# EAGLE design temphumidity_1.1 (EAGLE 9.6.2)

## Sheet 1 of 2
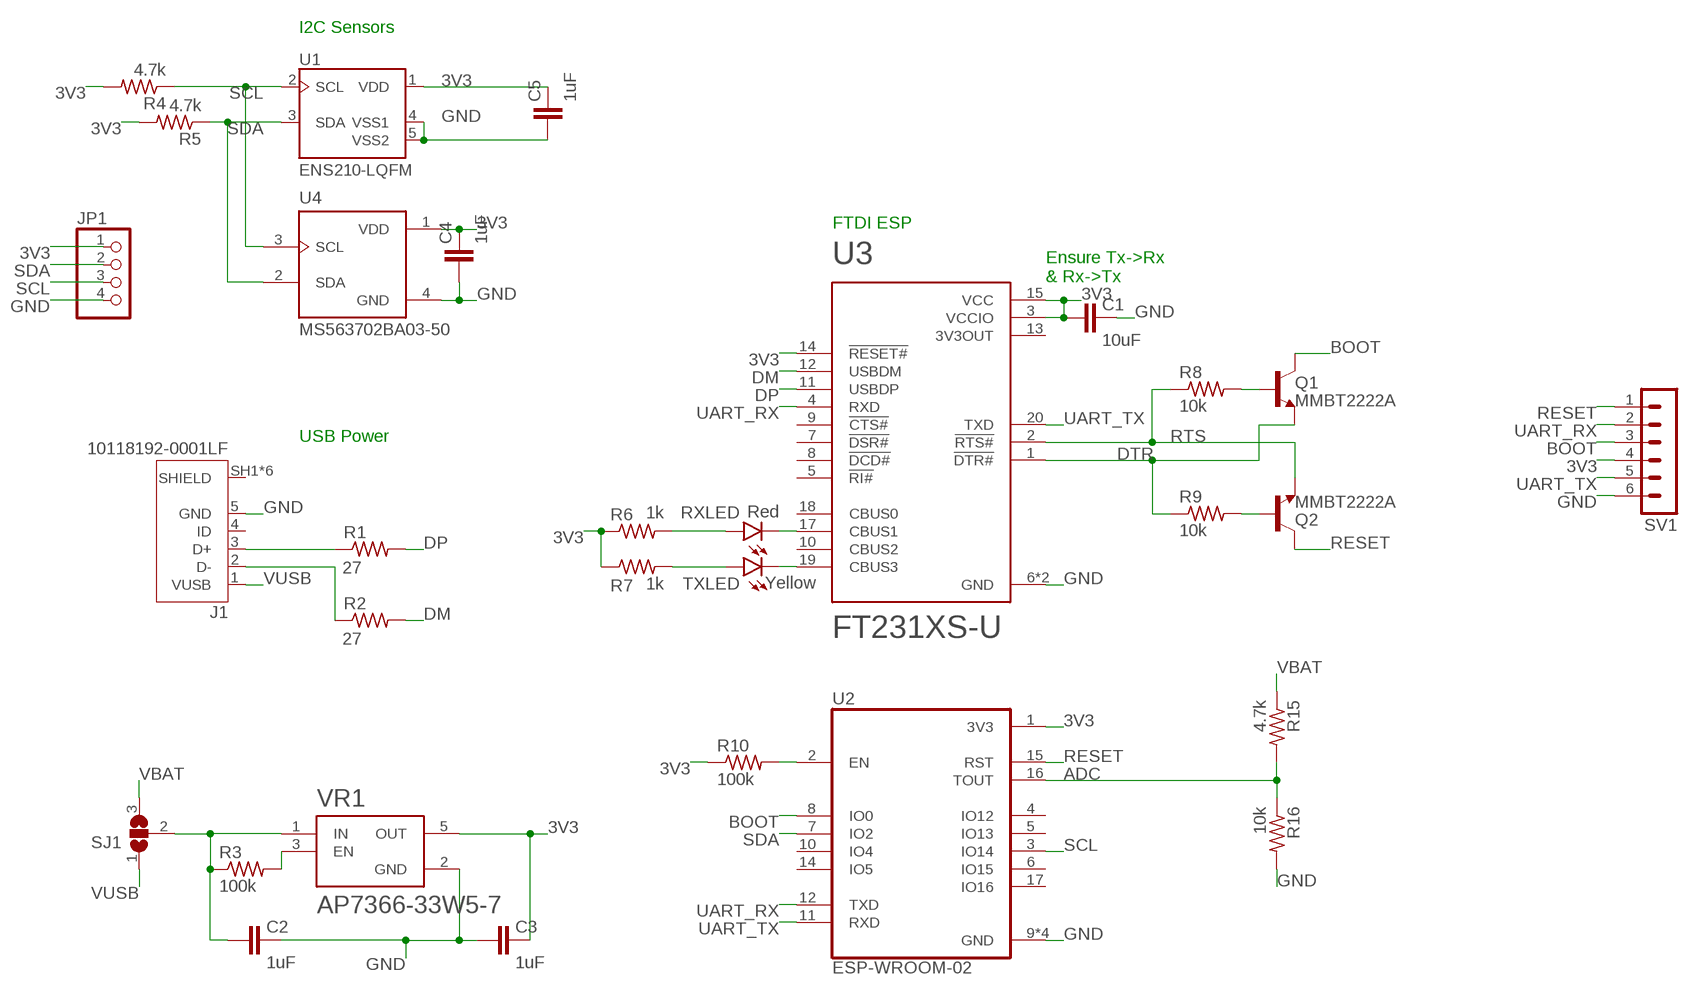
[diagram p0: schematic, sheet 1]

### Parts
C1  10uF  C-EUC0805  [C0805]
C2  1uF  C-EUC0805  [C0805]
C3  1uF  C-EUC0805  [C0805]
C4  1uF  C-EUC0805  [C0805]
C5  1uF  C-EUC0805  [C0805]
J1  10118192-0001LF  [AMPHENOL_10118192-0001LF]
JP1  PINHD-1X4  [1X04]
Q1  MMBT2222A  [SOT23]
Q2  MMBT2222A  [SOT23]
R1  27  R-US_R0805  [R0805]
R2  27  R-US_R0805  [R0805]
R3  100k  R-US_R0805  [R0805]
R4  4.7k  R-US_R0805  [R0805]
R5  4.7k  R-US_R0805  [R0805]
R6  1k  R-US_R0805  [R0805]
R7  1k  R-US_R0805  [R0805]
R8  10k  R-US_R0805  [R0805]
R9  10k  R-US_R0805  [R0805]
R10  100k  R-US_R0805  [R0805]
R15  4.7k  R-US_R0805  [R0805]
R16  10k  R-US_R0805  [R0805]
RXLED  Red  LEDCHIP-LED0805  [CHIP-LED0805]
SJ1  SJ2W  [SJ_2]
SV1  MA06-1  [MA06-1]
TXLED  Yellow  LEDCHIP-LED0805  [CHIP-LED0805]
U1  ENS210-LQFM  [SON95P200X200X80-5N160X70]
U2  ESP-WROOM-02  [MODULE_ESP-WROOM-02]
U3  FT231XS-U  [SOP63P600X175-20N]
U4  MS563702BA03-50  [TE_MS563702BA03-50]
VR1  AP7366-33W5-7  [SOT95P285X140-5N]

### Nets
3V3: C1.2 C3.1 C4.1 C5.1 JP1.1 R4.2 R5.2 R6.1 R7.1 R10.1 SV1.4 U1.1(VDD) U2.1(3V3) U3.3(VCCIO) U3.14(!RESET#) U3.15(VCC) U4.1(VDD) VR1.5(OUT)
ADC: R15.2 R16.1 U2.16(TOUT)
BOOT: Q1.3(C) SV1.3 U2.8(IO0)
DM: R2.2 U3.12(USBDM)
DP: R1.2 U3.11(USBDP)
DTR: Q1.2(E) R9.1 U3.1(!DTR#)
GND: C1.1 C2.1 C3.2 C4.2 C5.2 J1.5(GND) JP1.4 R16.2 SV1.6 U1.4(VSS1) U1.5(VSS2) U2.9(GND) U2.13(GND) U2.18(GND) U2.19(GND) U3.6(GND) U3.16(GND) U4.4(GND) VR1.2(GND) ; also sheet 2
N$1: J1.3(D+) R1.1
N$2: J1.2(D-) R2.1
N$3: R3.2 VR1.3(EN)
N$7: RXLED.C U3.17(CBUS1)
N$8: TXLED.C U3.19(CBUS3)
N$9: R6.2 RXLED.A
N$10: R7.2 TXLED.A
N$11: Q1.1(B) R8.2
N$12: Q2.1(B) R9.2
N$13: R10.2 U2.2(EN)
RESET: Q2.3(C) SV1.1 U2.15(RST)
RTS: Q2.2(E) R8.1 U3.2(!RTS#)
SCL: JP1.3 R4.1 U1.2(SCL) U2.3(IO14) U4.3(SCL)
SDA: JP1.2 R5.1 U1.3(SDA) U2.7(IO2) U4.2(SDA)
SELECTEDVOLTAGE: C2.2 R3.1 SJ1.2 VR1.1(IN)
UART_RX: SV1.2 U2.12(TXD) U3.4(RXD)
UART_TX: SV1.5 U2.11(RXD) U3.20(TXD)
VBAT: R15.1 SJ1.3 ; also sheet 2
VUSB: J1.1(VUSB) SJ1.1 ; also sheet 2
Unconnected: J1.4(ID) J1.SH1(SHIELD) J1.SH2(SHIELD) J1.SH3(SHIELD) J1.SH4(SHIELD) J1.SH5(SHIELD) J1.SH6(SHIELD) U2.4(IO12) U2.5(IO13) U2.6(IO15) U2.10(IO4) U2.14(IO5) U2.17(IO16) U3.5(!RI#) U3.7(!DSR#) U3.8(!DCD#) U3.9(!CTS#) U3.10(CBUS2) U3.18(CBUS0)

### Notes on the sheet
- I2C Sensors
- FTDI ESP
- Ensure Tx->Rx 
  & Rx->Tx
- USB Power

## Sheet 2 of 2
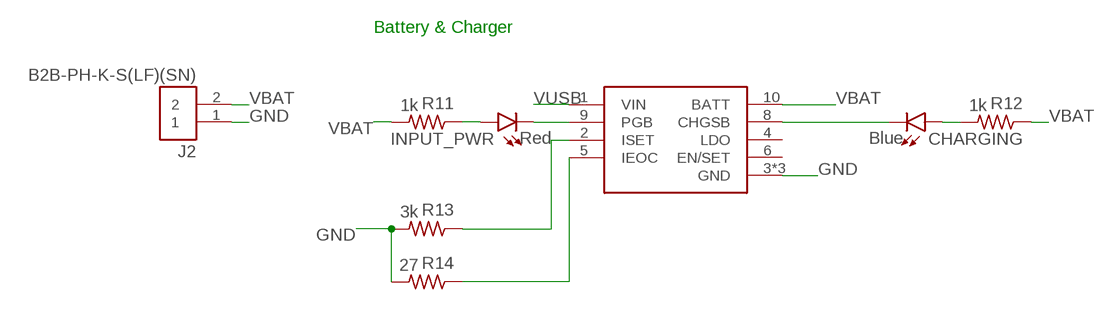
[diagram p1: schematic, sheet 2]

### Parts
CHARGING  Blue  LEDCHIP-LED0805  [CHIP-LED0805]
INPUT_PWR  Red  LEDCHIP-LED0805  [CHIP-LED0805]
J2  B2B-PH-K-S(LF)(SN)  [JST_B2B-PH-K-S(LF)(SN)]
R11  1k  R-US_R0805  [R0805]
R12  1k  R-US_R0805  [R0805]
R13  3k  R-US_R0805  [R0805]
R14  27  R-US_R0805  [R0805]
U$2  RT9532GQW  [SON50P300X300X80-11N]

### Nets
GND: J2.1 R13.2 R14.2 U$2.3(GND) U$2.7(GND) U$2.11(GND) ; also sheet 1
N$14: INPUT_PWR.C U$2.9(PGB)
N$15: CHARGING.C U$2.8(CHGSB)
N$16: INPUT_PWR.A R11.1
N$17: R13.1 U$2.2(ISET)
N$18: CHARGING.A R12.2
N$19: R14.1 U$2.5(IEOC)
VBAT: J2.2 R11.2 R12.1 U$2.10(BATT) ; also sheet 1
VUSB: U$2.1(VIN) ; also sheet 1
Unconnected: U$2.4(LDO) U$2.6(EN/SET)

### Notes on the sheet
- Battery & Charger

## Power pins joined to a net without a drawn wire
3V3OUT: U3.13(3V3OUT)

## Library data of the parts
C1-C5 = rcl:C-EU: CAPACITOR, European symbol; SPICEPREFIX: C
CHARGING INPUT_PWR RXLED TXLED = led:LED: LED OSRAM: - CHIPLED LG R971, LG N971, LY N971, LG Q971, LY Q971, LO R971, LY R971 LH N974, LH R974 LS Q976, LO Q976, LY Q976 LO Q996 - Hyper CHIPLED LW Q18S LB Q993, LB Q99A, LB R99A - SideLED LS A670, LO A670, LY A670, LG A670, LP A670 LB A673, LV A673, LT A673, LW A673 LH A674 LY A675 LS A676, LA A676, LO A676, LY A676, LW A676 LS A679, LY A679, LG A679 - Hyper Micro SIDELED® LS Y876, LA Y876, LO Y876, LY Y876 LT Y87S - SmartLED LW L88C, LW L88S LB L89C, LB L89S, LG L890 LS L89K, LO L89K, LY L89K LS L896, LA L896, LO L896, LY L896 - TOPLED LS T670, LO T670, LY T670, LG T670, LP T670 LSG T670, LSP T670, LSY T670, LOP T670, LYG T670 LG T671, LOG T671, LSG T671 LB T673, LV T673, LT T673, LW T673 LH T674 LS T676, LA T676, LO T676, LY T676, LB T676, LH T676, LSB T676, LW T676 LB T67C, LV T67C, LT T67C, LS T67K, LO T67K, LY T67K, LW E67C LS E67B, LA E67B, LO E67B, LY E67B, LB E67C, LV E67C, LT E67C LW T67C LS T679, LY T679, LG T679 LS T770, LO T770, LY T770, LG T770, LP T770 LB T773, LV T773, LT T773, LW T773 LH T774 LS E675, LA E675, LY E675, LS T675 LS T776, LA T776, LO T776, LY T776, LB T776 LHGB T686 LT T68C, LB T68C - Hyper Mini TOPLED® LB M676 - Mini TOPLED Santana® LG M470 LS M47K, LO M47K, LY M47K Source: http://www.osram.convergy.de LUXEON: - LUMILED® LXK2-PW12-R00, LXK2-PW12-S00, LXK2-PW14-U00, LXK2-PW14-V00 LXK2-PM12-R00, LXK2-PM12-S00, LXK2-PM14-U00 LXK2-PE12-Q00, LXK2-PE12-R00, LXK2-PE12-S00, LXK2-PE14-T00, LXK2-PE14-U00 LXK2-PB12-K00, LXK2-PB12-L00, LXK2-PB12-M00, LXK2-PB14-N00, LXK2-PB14-P00, LXK2-PB14-Q00 LXK2-PR12-L00, LXK2-PR12-M00, LXK2-PR14-Q00, LXK2-PR14-R00 LXK2-PD12-Q00, LXK2-PD12-R00, LXK2-PD12-S00 LXK2-PH12-R00, LXK2-PH12-S00 LXK2-PL12-P00, LXK2-PL12-Q00, LXK2-PL12-R00 Source: www.luxeon.com KINGBRIGHT: KA-3528ASYC Source: www.kingbright.com
J1 = USB-Micro-Connector:10118192-0001LF: Single Port 5 Contact Horizontal Right Angle Shielded Micro B USB 2.0 Connector Check prices <https://pricing.snapeda.com/parts/10118192-0001LF/AMPHENOL%20ICC%20/%20FCI/view-part?ref=eda>; AVAILABILITY: In Stock; DESCRIPTION: USB - micro B USB 2.0 Receptacle Connector 5 Position Surface Mount, Right Angle; MF: AMPHENOL ICC / FCI; MP: 10118192-0001LF; PACKAGE: None; PRICE: None; PURCHASE-URL: https://pricing.snapeda.com/search/part/10118192-0001LF/?ref=eda
J2 = B2B-PH-K-S_LF__SN_:B2B-PH-K-S(LF)(SN): PH Series 2 Position 2 mm Pitch Through Hole Top Entry Shrouded Header Check prices <https://pricing.snapeda.com/parts/B2B-PH-K-S%28LF%29%28SN%29/JST%20Sales/view-part?ref=eda>; AVAILABILITY: In Stock; DESCRIPTION: Connector Header Through Hole 2 position 0.079 (2.00mm); MF: JST Sales; MP: B2B-PH-K-S(LF)(SN); PACKAGE: None; PRICE: None; PURCHASE-URL: https://pricing.snapeda.com/search/part/B2B-PH-K-S(LF)(SN)/?ref=eda
JP1 = pinhead:PINHD-1X4: PIN HEADER
Q1 Q2 = MMBT2222A:MMBT2222A: 2N2222 General Purpose NPN Transistor Check prices <https://pricing.snapeda.com/parts/MMBT2222A/ON%20Semiconductor/view-part?ref=eda>; AVAILABILITY: In Stock; DESCRIPTION: Bipolar (BJT) Transistor NPN 40V 600mA 300MHz 330mW Surface Mount SOT-23-3; MF: ON Semiconductor; MP: MMBT2222A; PACKAGE: SC-75 ON Semiconductor; PRICE: None; PURCHASE-URL: https://pricing.snapeda.com/search/part/MMBT2222A/?ref=eda
R1-R16 = rcl:R-US_: RESISTOR, American symbol; SPICEPREFIX: R
SJ1 = jumper:SJ2W: SMD solder JUMPER
SV1 = con-lstb:MA06-1: PIN HEADER; OC_FARNELL: unknown; OC_NEWARK: unknown
U1 = ENS210-LQFM:ENS210-LQFM: ENS210 Series 3.6V 100%RH Relative Humidity & Temperature Sensor w/I²C Interface Check prices <https://pricing.snapeda.com/parts/ENS210-LQFM/ams/view-part?ref=eda>; AVAILABILITY: In Stock; DESCRIPTION: Humidity Temperature Sensor 0 ~ 100% RH I²C ±3.5% RH 3s Surface Mount; MF: ams; MP: ENS210-LQFM; PACKAGE: QFN-4 ams; PRICE: None; PURCHASE-URL: https://pricing.snapeda.com/search/part/ENS210-LQFM/?ref=eda
U2 = ESP-WROOM-02:ESP-WROOM-02: Wi-Fi Module w/ESP8266 802.11b/g/n 20dBm 20x18x3mm Check prices <https://pricing.snapeda.com/parts/ESP-WROOM-02/Espressif%20Systems/view-part?ref=eda>; AVAILABILITY: In Stock; DESCRIPTION: WiFi 802.11b/g/n Transceiver Module 2.4GHz ~ 2.5GHz Integrated, Trace Surface Mount; MF: Espressif Systems; MP: ESP-WROOM-02; PACKAGE: SMD-18 Espressif Systems; PRICE: None; PURCHASE-URL: https://pricing.snapeda.com/search/part/ESP-WROOM-02/?ref=eda
U3 = FT231XS-U:FT231XS-U: USB Full Speed to Full Handshake UART with USB Charger Detection, SSOP-20 Check prices <https://pricing.snapeda.com/parts/FT231XS-U/FTDI%20Chip/view-part?ref=eda>; AVAILABILITY: In Stock; DESCRIPTION: USB Bridge, USB to UART USB 2.0 UART Interface 20-SSOP; MF: FTDI Chip; MP: FT231XS-U; PACKAGE: SSOP-20 FTDI; PRICE: None; PURCHASE-URL: https://pricing.snapeda.com/search/part/FT231XS-U/?ref=eda
U4 = MS563702BA03-50:MS563702BA03-50: SENSOR 17.4PSIA I2C 24B 4-QFN Check prices <https://pricing.snapeda.com/parts/MS563702BA03-50/TE%20Connectivity/view-part?ref=eda>; AVAILABILITY: In Stock; COMMENT: MS563702BA03-50; DESCRIPTION: MS5637-02BA03 Series 1 to 200 kPa Low Voltage Barometric Pressure Sensor; EU_ROHS_COMPLIANCE: Compliant; MF: TE Connectivity; MP: MS563702BA03-50; PACKAGE: SMD-4 Measurement Specialties; PRICE: None; PURCHASE-URL: https://pricing.snapeda.com/search/part/MS563702BA03-50/?ref=eda
U$2 = SON50P300X300X80-11N:RT9532GQW
VR1 = AP7366-33W5-7:AP7366-33W5-7: Linear Voltage Regulator IC 1 Output 600mA SOT-25 Check prices <https://pricing.snapeda.com/parts/AP7366-33W5-7/Diodes%20Zetex/view-part?ref=eda>; AVAILABILITY: In Stock; DESCRIPTION: LDO Regulator Pos 3.3V 0.6A 5-Pin SOT-25 T/R; MF: Diodes Zetex; MP: AP7366-33W5-7; PACKAGE: None; PRICE: None; PURCHASE-URL: https://pricing.snapeda.com/search/part/AP7366-33W5-7/?ref=eda

## Board
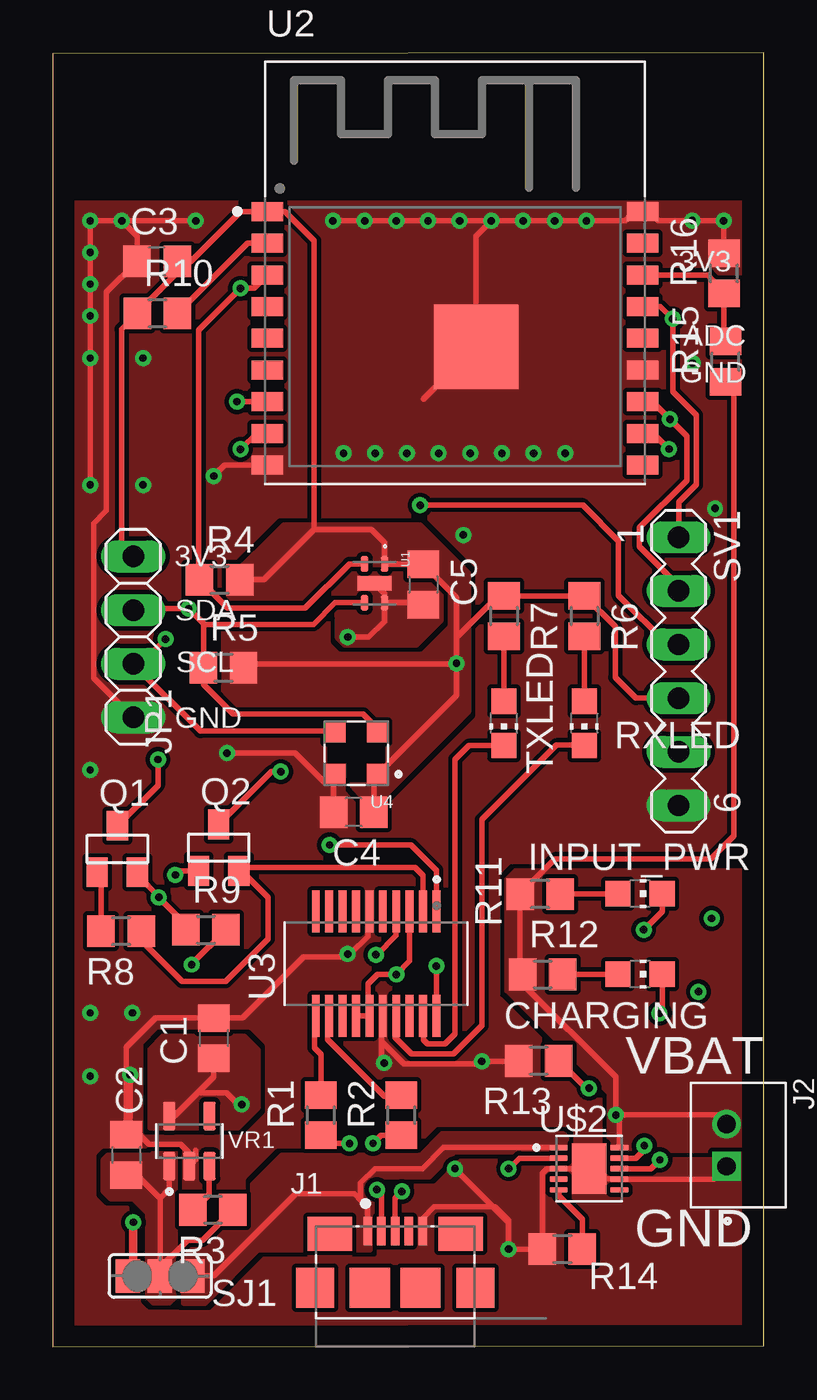
[diagram p2: board, top side]
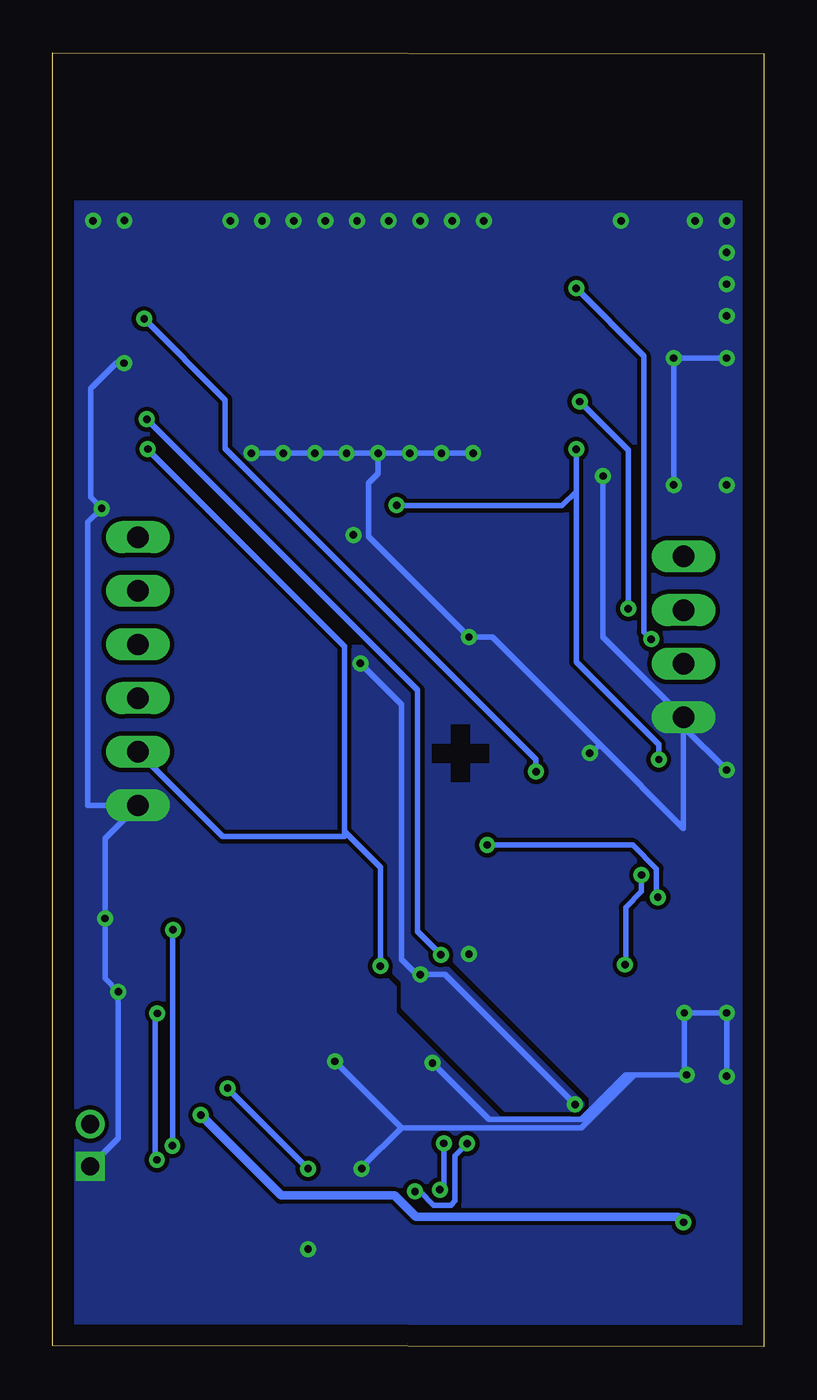
[diagram p3: board, bottom side, seen from below]

Size 33.68 x 61.26 mm. Coordinates in mm from the lower left corner, seen from the top.
Outline: 0,0 33.68,0.05 33.68,61.26 0,61.21 0,0
Copper layers (1*16): Top 0.035mm / dielectric 1.5mm / Bottom 0.035mm
Design rules "default *": minimum track width 10mil, minimum drill 0.35mm, track to track 8mil, track to pad 8mil, pad to pad 7mil, via to via 8mil, smd to smd 7mil, copper to edge 40mil, drill to drill 6mil, minimum pad ring 10mil, minimum via ring 8mil, stop-mask expansion 4mil, vias tented up to drill 0mil, thermal gap 10mil

### Footprints (pad centres in the part's own frame; a part is rotated, then mirrored left to right if it is on the bottom)
C0805 = smd 1.3 x 1.5: 1 -0.95,0; 2 0.95,0
CHIP-LED0805 = smd 1.2 x 1.2: A 0,-1.05; C 0,1.05
AMPHENOL_10118192-0001LF = smd 0.4 x 1.35: 1 -1.3,0; 2 -0.65,0; 3 0,0; 4 0.65,0; 5 1.3,0 | smd 2.1 x 1.6: SH1 -3.1,-0.125; SH2 3.1,-0.125 | smd 1.8 x 1.9: SH3 -3.8,-2.675; SH6 3.8,-2.675 | smd 1.9 x 1.9: SH4 -1.2,-2.675; SH5 1.2,-2.675
JST_B2B-PH-K-S(LF)(SN) = drill 0.86 square: 1 1,-0.55 | drill 0.86: 2 -1,-0.55
1X04 = drill 1.016 long: 1 -3.81,0; 2 -1.27,0; 3 1.27,0; 4 3.81,0
SOT23 = smd 1 x 1.4: 1 -0.95,-1.1; 2 0.95,-1.1; 3 0,1.1
R0805 = smd 1.3 x 1.5: 1 -0.95,0; 2 0.95,0
SJ_2 = smd 1.168 x 1.6: 1 -1.524,0; 2 0,0; 3 1.524,0
MA06-1 = drill 1.016 long: 1 -6.35,0; 2 -3.81,0; 3 -1.27,0; 4 1.27,0; 5 3.81,0; 6 6.35,0
SON95P200X200X80-5N160X70 = smd 0.73 x 0.37: 1 -0.92,0.475; 2 -0.92,-0.475; 3 0.92,-0.475; 4 0.92,0.475 | smd 0.7 x 1.6: 5 0,0
MODULE_ESP-WROOM-02 = smd 1.485 x 0.9: 1 -8.893,4.9; 2 -8.893,3.4; 3 -8.893,1.9; 4 -8.893,0.4; 5 -8.893,-1.1; 6 -8.893,-2.6; 7 -8.893,-4.1; 8 -8.893,-5.6; 9 -8.893,-7.1; 10 8.893,-7.1; 11 8.893,-5.6; 12 8.893,-4.1; 13 8.893,-2.6; 14 8.893,-1.1; 15 8.893,0.4; 16 8.893,1.9; 17 8.893,3.4; 18 8.893,4.9 | smd 4 x 4: 19 1,-1.5
SOP63P600X175-20N = smd 1.97 x 0.41: 1 -2.475,2.857; 2 -2.475,2.223; 3 -2.475,1.587; 4 -2.475,0.953; 5 -2.475,0.318; 6 -2.475,-0.318; 7 -2.475,-0.953; 8 -2.475,-1.587; 9 -2.475,-2.223; 10 -2.475,-2.857; 11 2.475,-2.857; 12 2.475,-2.223; 13 2.475,-1.587; 14 2.475,-0.953; 15 2.475,-0.318; 16 2.475,0.318; 17 2.475,0.953; 18 2.475,1.587; 19 2.475,2.223; 20 2.475,2.857
TE_MS563702BA03-50 = smd 1 x 1: 1 -1,1; 2 -1,-1; 3 1,-1; 4 1,1
SON50P300X300X80-11N = smd 0.86 x 0.28: 1 -1.435,1; 2 -1.435,0.5; 3 -1.435,0; 4 -1.435,-0.5; 5 -1.435,-1; 6 1.435,-1; 7 1.435,-0.5; 8 1.435,0; 9 1.435,0.5; 10 1.435,1 | smd 1.65 x 2.38: 11 0,0
SOT95P285X140-5N = smd 1.35 x 0.6: 1 -1.185,0.95; 2 -1.185,0; 3 -1.185,-0.95; 4 1.185,-0.95; 5 1.185,0.95

### Placement (x,y rotation side)
C1  7.62,14.61 270 top
C2  3.48,9.09 270 top
C3  4.94,51.38 180 top
C4  14.26,25.31 180 top
C5  17.55,36.09 270 top
CHARGING  27.81,17.64 270 top
INPUT_PWR  27.81,21.45 270 top
J1  16.21,5.47 0 top
J2  32.46,9.54 270 top
JP1  3.81,33.6 270 top
Q1  3.06,23.56 0 top
Q2  7.86,23.63 0 top
R1  12.7,10.97 90 top
R2  16.51,10.97 90 top
R3  7.58,6.48 180 top
R4  7.9,36.31 0 top
R5  8.09,32.15 0 top
R6  25.18,34.6 270 top
R7  21.37,34.6 270 top
R8  3.24,19.67 180 top
R9  7.25,19.74 0 top
R10  4.95,48.93 0 top
R11  23.08,21.43 180 top
R12  23.2,17.63 0 top
R13  23.01,13.54 180 top
R14  24.13,4.62 180 top
R15  31.86,46.64 90 top
R16  31.78,50.82 90 top
RXLED  25.18,29.52 180 top
SJ1  5.08,3.35 180 top
SV1  29.65,31.98 270 top
TXLED  21.37,29.52 180 top
U1  15.24,36.14 270 top
U2  19.05,48.84 0 top
U3  15.31,18.13 270 top
U4  14.37,28.1 180 top
U$2  25.4,8.43 0 top
VR1  6.47,9.74 90 top

### Tracks (layer width: path | path; a pad name or v marks a point on that pad's centre or on a via)
3V3  (via drill 0.35)
  Top 0.254: v16.27,17.62 15.37,17.62 14.93,17.19 14.93,15.72 U3.15 U3.14 | U3.3 | U3.3 16.9,18.26 v16.27,17.62 | v16.27,17.62 | v19.12,32.35 19.12,33.57 21.09,35.55 R7.1 R6.1 26.63,34.09 26.63,31.69 27.62,30.71 SV1.4 | JP1.1 3.25,37.97 3.25,48.18 R10.1 4,48.96 5.89,50.84 C3.1 6.53,51.38 8.89,53.74 U2.1 11,53.74 12.38,52.36 12.38,38.68 | R5.2 9.22,32.33 19.1,32.33 v19.12,32.35 | 12.38,38.68 15.11,38.68 15.71,38.07 U1.1 17.52,37.06 C5.1 19.12,35.47 v19.12,32.35 | 12.38,38.68 10.01,36.31 R4.2 | 6.86,12.02 5.76,10.92 VR1.5 | 6.86,12.02 8.22,12.02 8.77,11.47 v8.95,11.47 | C1.2 7.62,12.78 6.86,12.02 | v19.12,32.35 19.12,30.84 U4.1 15.21,26.93 C4.1
  Bottom 0.254: v8.95,11.47 15.1,17.62 v16.27,17.62 16.45,17.62 17.16,18.34 17.16,30.41 19.11,32.35 v19.12,32.35
  pour Top (rank 2, no thermals): 4.6,10.36 8.76,10.36 9.72,11.33 9.72,14.04 9.07,14.69 5.21,14.69 4.6,14.09
  pour Top (rank 2, no thermals): 14.96,25.7 15.3,25.7 19.68,30.08 19.68,36.61 17.38,38.91 10.95,38.91 8.34,36.29 8.34,35.61 8.09,35.36 8.09,29.85 11.25,29.85
  pour Bottom (rank 2, no thermals): 15.95,17.23 16.99,17.23 18.12,18.36 18.12,22.59 19.91,24.38 19.91,32.79 19.58,33.11 18.44,33.11 16.43,31.1 16.43,19.61 15.2,18.38 15.2,17.97
  pour Bottom: 15.13,18 8.52,11.39 8.78,11.14 12.14,11.14 17.08,16.08 17.08,17.28
ADC
  Top 0.254: U2.16 31.02,50.75 31.84,49.93 R16.1 31.79,47.66 R15.2
BOOT  (via drill 0.35)
  Top 0.254: U2.8 9.64,43.24 v8.89,42.49 | v4.98,27.8 4.98,26.58 Q1.3 | v17.4,39.84 25.13,39.84 25.13,39.82 26.79,38.16 26.79,35.58 29.12,33.25 SV1.3
  Bottom 0.254: v4.98,27.8 4.98,28.52 8.89,32.43 8.89,40.5 | 8.89,40.5 v8.89,42.49 | 8.89,40.5 9.56,39.82 17.23,39.82 17.24,39.84 v17.4,39.84
DM
  Top 0.254: U3.12 13.01,15.58 13.01,14.55 15.72,11.84 16.43,11.84 R2.2
DP
  Top 0.254: R1.2 12.7,13.84 12.39,14.15 12.39,15.59 U3.11
DTR  (via drill 0.35)
  Top 0.254: U3.1 18.17,22.56 16.97,23.76 v13.11,23.76 | Q1.2 4.01,22.34 5.02,21.33 v5.02,21.28 6.3,20 R9.1
  Bottom 0.254: v5.02,21.28 5.09,21.35 5.09,22.63 6.22,23.76 v13.11,23.76
GND  (via drill 0.35)
  Top 0.254: J2.1 31.3,7.93 U$2.7 25.89,7.94 U$2.11 U$2.3 23.4,8.42 23.18,8.2 R14.2 v21.59,4.62 | J1.5 17.52,5.48 17.52,6.09 18.06,6.63 20.94,6.63 21.59,5.98 v21.59,4.62 | R13.2 22.03,13.51 v20.32,13.51 20.21,13.39 16.63,13.39 15.56,14.47 | 15.56,14.47 15.56,15.59 U3.16 | v7.62,41.22 8.14,41.74 U2.9 | U3.6 14.92,20.54 14.92,19.43 14.08,18.59 v13.97,18.59 13.84,18.46 11.89,18.46 8.99,15.56 C1.1 4.87,15.56 3.47,14.17 3.47,10.67 | 3.47,10.67 3.66,10.85 v3.66,12.87 3.64,12.85 3.64,10.52 4.57,9.58 6.06,9.58 6.43,9.21 6.43,8.59 VR1.2 6.76,8.85 6.76,9.3 | 3.47,10.67 C2.1 | JP1.4 | JP1.4 1.94,31.66 1.94,38.98 2.54,39.58 2.54,49.93 C3.2 3.99,52.59 v3.27,53.31 | v19.05,8.43 21.59,5.89 v21.59,4.62 | 17.56,44.86 U2.19 20.05,52.59 v20.77,53.31 | v15.7,13.44 15.56,13.58 15.56,14.47 | v20.77,53.31 v22.27,53.31 v23.77,53.31 v25.27,53.31 27.12,53.31 27.55,53.74 U2.18 28.25,53.74 28.67,53.33 v30.29,53.33 v30.3,53.32 v31.76,53.32 v31.77,53.31 31.77,51.78 R16.2 | v20.77,53.31 v19.27,53.31 v17.77,53.31 v16.27,53.31 v14.77,53.31 v13.27,53.31 | v6.77,53.31 v3.27,53.31 | v3.27,53.31 v1.77,53.31 v1.77,51.81 v1.77,50.31 v1.77,48.81 v1.77,46.81 v1.77,40.81 | v8.25,28.1 11.47,28.1 12.87,26.7 12.98,26.7 U4.4 13.31,27.03 C4.2 | U1.4 15.71,35.22 15.71,34.35 14.96,33.6 v13.97,33.6 | 17.52,35.17 C5.2 17.46,35.22 U1.4 | U1.4 15.71,35.67 U1.5
  Bottom 0.254: v3.66,12.87 6.13,12.87 8.64,10.36 17.17,10.36 | 17.17,10.36 v20.32,13.51 | v7.62,41.22 7.62,33.6 JP1.4 | v30.3,46.57 30.68,46.57 31.9,45.36 31.9,40.22 v31.37,39.69 v31.38,39.69 32.02,39.05 32.02,25.63 SV1.6 31.2,24.07 v31.2,20.28 31.2,17.44 v30.58,16.81 30.58,9.87 J2.1 | v19.05,8.43 19.05,8.48 17.17,10.36 | JP1.4 3.81,24.55 7.78,28.52 | v3.66,12.87 6.55,12.87 8.65,10.76 13.02,10.76 v15.7,13.44 | 7.78,28.52 12.87,33.6 v13.97,33.6 18.72,38.35 18.72,40.89 18.27,41.34 v18.27,42.31 | v1.77,46.81 v4.27,46.81 v4.27,40.81 | v1.77,27.31 3.81,29.35 JP1.4 | v3.66,12.87 3.77,12.98 v3.77,15.81 v1.77,15.81 v1.77,12.81 | v13.77,42.31 v15.27,42.31 v16.77,42.31 v18.27,42.31 | v18.27,42.31 v19.77,42.31 v21.27,42.31 v22.77,42.31 v24.27,42.31 | v8.25,28.1 8.2,28.1 7.78,28.52
  other vias: 19.44,38.44
  pour Top (rank 6, no thermals): -0.01,54.15 36.11,54.15 36.11,-0.46 -0.01,-0.46
  pour Bottom (rank 6, no thermals): 0,54.15 38.1,54.15 38.1,-0.46 0,-0.46
  pour Top (no thermals): 13.85,33.22 17.2,33.22 18.38,34.4 18.38,35.92 17.73,36.57 14.53,36.57 14.33,36.37 13.49,35.53 13.49,33.76 13.49,33.58 13.85,33.21
N$1  (via drill 0.35)
  Top 0.254: J1.3 16.21,7.03 v16.53,7.35 | v14.05,9.62 13.1,9.62 R1.1
  Bottom 0.254: v14.05,9.62 14.63,9.04 14.63,6.9 14.82,6.7 15.64,6.7 16.29,7.35 v16.53,7.35
N$2  (via drill 0.35)
  Top 0.254: J1.2 15.57,7.21 v15.35,7.43 v15.35,7.44 | v15.16,9.63 15.55,10.02 R2.1
  Bottom 0.254: v15.16,9.63 15.16,7.62 v15.35,7.44
N$3
  Top 0.254: VR1.3 7.41,8.54 7.41,7.19 6.7,6.48 R3.2
N$7
  Top 0.254: U3.17 16.2,15.59 16.2,14.65 17,13.86 18.97,13.86 20.32,15.21 20.32,24.96 23.84,28.49 25.15,28.49 RXLED.C
N$8
  Top 0.254: TXLED.C 19.71,28.47 19.05,27.81 19.05,14.81 18.59,14.34 17.74,14.34 17.55,14.54 U3.19
N$9
  Top 0.254: R6.2 RXLED.A
N$10
  Top 0.254: R7.2 TXLED.A
N$11
  Top 0.254: Q1.1 2.29,22.28 R8.2
N$12  (via drill 0.35)
  Top 0.254: v6.58,18.09 6.58,18.12 R9.2 | v5.8,22.34 5.99,22.53 Q2.1
  Bottom 0.254: v5.8,22.34 5.8,21.55 6.55,20.8 6.55,18.12 v6.58,18.09
N$13
  Top 0.254: R10.2 9.22,52.24 U2.2
N$14  (via drill 0.35)
  Top 0.254: v28.02,9.52 28.01,9.51 28.01,9.31 27.62,8.93 U$2.9 | v27.99,19.74 28.86,20.62 INPUT_PWR.C
  Bottom 0.254: v28.02,9.52 28,9.53 28,19.72 v27.99,19.74
N$15  (via drill 0.35)
  Top 0.254: v28.75,8.85 28.32,8.42 U$2.8 | CHARGING.C 28.86,15.92 v28.73,15.78
  Bottom 0.254: v28.73,15.78 28.84,15.68 28.84,8.94 v28.75,8.85
N$16
  Top 0.254: INPUT_PWR.A 26.74,21.43 R11.1
N$17  (via drill 0.35)
  Top 0.254: v21.59,8.43 22.09,8.93 U$2.2 | v25.4,12.24 25.26,12.24 R13.1
  Bottom 0.254: v21.59,8.43 v25.4,12.24
N$18
  Top 0.254: CHARGING.A 26.75,17.63 R12.2
N$19
  Top 0.254: R14.1 25.08,6.03 23.96,7.15 U$2.5
RESET  (via drill 0.35)
  Top 0.254: v10.79,27.23 10.36,27.23 Q2.3 | v29.36,48.67 28.78,49.24 U2.15 | SV1.1 29.64,39.99 30.48,40.82 30.48,44.1 29.36,45.22 v29.36,48.67 | v29.36,48.67
  Bottom 0.254: v10.79,27.23 10.79,27.8 25.51,42.51 25.51,44.83 v29.36,48.67
RTS
  Top 0.254: U3.2 17.54,22.31 17.15,22.7 8.98,22.7 Q2.2 8.94,22.53 10.19,21.28 10.19,19.3 8.19,17.3 6.12,17.3 4.19,19.23 R8.1
SCL  (via drill 0.35)
  Top 0.254: U2.3 9.53,50.11 v8.89,50.11 6.91,48.14 6.91,36.35 R4.1 8.29,34.97 11.95,34.97 14.04,37.06 U1.2 | v5.34,33.5 4.18,32.33 JP1.3 7,29.14 13.33,29.14 U4.3
  Bottom 0.254: v8.89,50.11 5.69,46.91 5.69,33.84 v5.34,33.5
SDA  (via drill 0.35)
  Top 0.254: U2.7 | U2.7 v8.73,44.74 v8.72,44.75 | JP1.2 3.88,34.94 v6.43,34.94 7.14,34.24 R5.1 | R5.1 7.14,34.21 12.35,34.21 13.37,35.22 U1.3 | U4.2 15.37,29.28 14.7,29.95 8.54,29.95 7.14,31.35 R5.1
  Bottom 0.254: v6.43,34.94 6.43,42.46 v8.72,44.75
SELECTEDVOLTAGE
  Top 0.254: R3.1 8.52,6.48 7.09,5.05 6.38,5.05 5.08,3.75 SJ1.2 5.08,7.02 | 5.08,7.02 3.97,8.14 C2.2 | VR1.1 5.52,7.46 5.08,7.02
  pour Top (rank 2, no thermals): 4.48,2.36 4.48,6.34 3.82,7 2.76,7 2.38,7.38 2.38,8.83 2.61,9.06 4.69,9.06 5.02,9.38 5.79,9.38 5.79,2.35 5.52,2.07 4.77,2.07
UART_RX  (via drill 0.35)
  Top 0.254: U3.4 16.27,19.47 15.35,18.56 v15.3,18.56 | U2.12 28.4,44.74 v29.23,43.91 30.02,43.13 30.02,41.01 27.79,38.78 27.79,37.87 29.64,36.02 SV1.2
  Bottom 0.254: v29.23,43.91 16.41,31.09 16.41,19.66 v15.3,18.56
UART_TX  (via drill 0.35)
  Top 0.254: U3.20 18.17,17.37 v18.17,18.03 | U2.11 28.44,43.24 v29.18,42.5
  Bottom 0.254: v18.17,18.03 18.17,22.7 19.85,24.39 | v29.18,42.5 v29.18,42.49 19.85,33.16 19.85,24.39 | SV1.5 25.63,24.16 19.85,24.16 19.85,24.39
VBAT  (via drill 0.35)
  Top 0.254: 3.81,3.6 SJ1.3 | v26.67,10.97 26.67,12.77 22.25,17.19 R12.1 22.13,17.75 R11.2 23.79,23.09 31.16,23.09 32.26,24.19 32.26,45.29 R15.1 | v26.67,10.97 31.48,10.97 J2.2 | U$2.10 26.84,10.8 v26.67,10.97
  Top 0.406: v3.81,5.89 3.81,3.6
  Bottom 0.406: v3.81,5.89 4.08,6.15 16.49,6.15 17.49,7.16 22.86,7.16 v26.67,10.97
  pour Top (rank 2, no thermals): 34.11,9.23 26.32,9.23 26.32,11.94 21.45,16.81 21.45,22.16 21.88,22.59 34.11,22.59
VUSB
  Top 0.254: U$2.1 18.51,9.43 17.51,8.43 15.25,8.43 14.57,7.75 14.57,6.95 14.63,6.9 | 14.63,6.9 14.63,6.88 14.28,7.23 11.5,7.23 7.62,3.35 SJ1.1 | 14.63,6.9 14.91,6.62 J1.1
  pour Top (rank 3, no thermals): 5.93,4.91 5.93,2.35 6.22,2.07 7.19,2.07 9.71,4.58 15.03,4.58 15.22,4.76 15.22,6.79 14.91,7.09 14.91,7.68 15.27,8.04 17.82,8.04 19,9.22 24.29,9.22 24.54,9.47 24.54,9.7 24.17,10.07 18.44,10.07 17.43,9.07 10.85,9.07 9.46,7.67 9.46,6.9 7.46,4.91

### Text on the board
tNames: 3V3 | ADC | GND | 3V3 | SDA | SCL | GND | VBAT | GND